# EAGLE design HW2 (EAGLE 7.5.0)
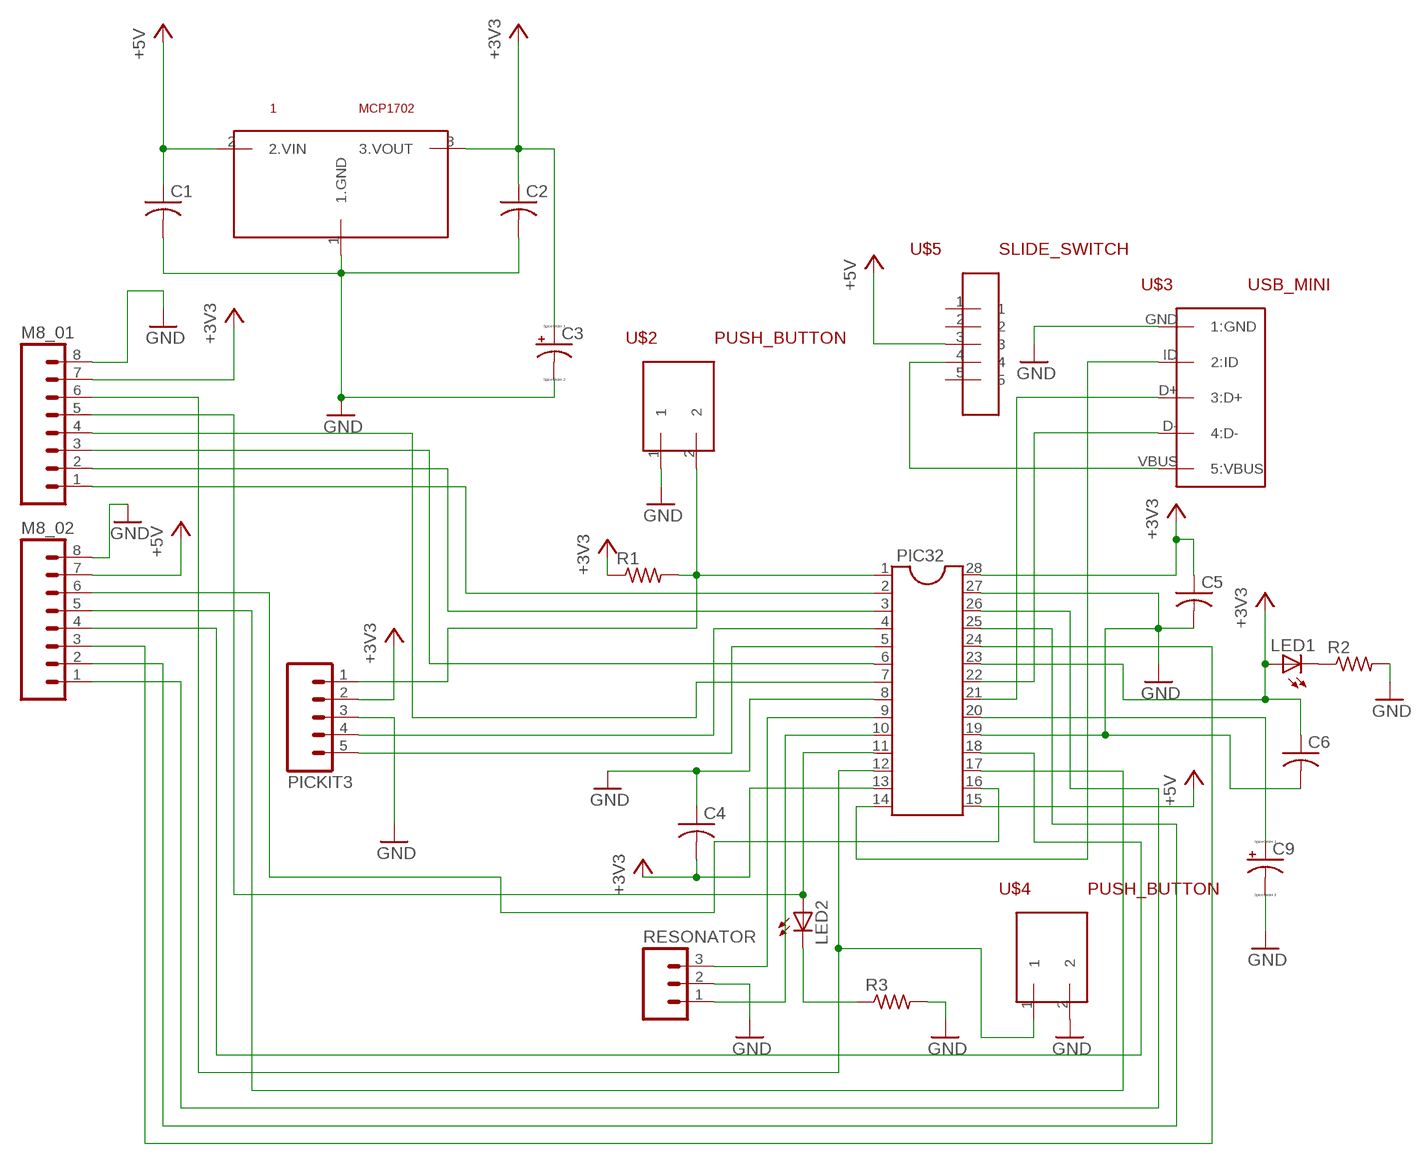
[diagram p0: schematic, sheet 1]

## Parts
1  MCP1702  [TO92]
C1  C-US025-025X050  [C025-025X050]
C2  C-US025-025X050  [C025-025X050]
C3  CPOL-USE5-5  [E5-5]
C4  C-US025-025X050  [C025-025X050]
C5  C-US025-025X050  [C025-025X050]
C6  C-US025-025X050  [C025-025X050]
C9  CPOL-USE5-5  [E5-5]
LED1  LED3MM  [LED3MM]
LED2  LED3MM  [LED3MM]
M8_01  M08  [1X08_ROUND]
M8_02  M08  [1X08_ROUND]
PIC32  DIL28-3  [DIL28-3]
PICKIT3  M05PTH  [1X05]
R1  R-US_0207/10  [0207/10]
R2  R-US_0207/10  [0207/10]
R3  R-US_0207/10  [0207/10]
RESONATOR  M03PTH  [1X03]
U$2  PUSH_BUTTON  [1X02_NO_SILK]
U$3  USB_MINI  [USB-MB-H]
U$4  PUSH_BUTTON  [1X02_NO_SILK]
U$5  SLIDE_SWITCH  [1X05]

## Nets
+3V3: 1.3(3.VOUT) C2.1 C3.+ C4.2 C5.1 C6.1 LED1.A M8_01.7 PIC32.13 PIC32.23 PIC32.28 PICKIT3.2 R1.1
+5V: 1.2(2.VIN) C1.1 M8_02.7 PIC32.15 U$5.3
GND: 1.1(1.GND) C1.2 C2.2 C3.- C4.1 C5.2 C6.2 C9.- M8_01.8 M8_02.8 PIC32.8 PIC32.19 PIC32.27 PICKIT3.3 R2.2 R3.2 RESONATOR.2 U$2.1 U$3.GND(1:GND) U$4.2
N$1: PIC32.5 PICKIT3.5
N$2: PIC32.1(1:!MCLR) PICKIT3.1 R1.2 U$2.2
N$3: U$3.VBUS(5:VBUS) U$5.4
N$4: PIC32.14 U$3.ID(2:ID)
N$5: PIC32.4 PICKIT3.4
N$6: PIC32.21 U$3.D+(3:D+)
N$7: PIC32.22 U$3.D-(4:D-)
N$8: PIC32.9 RESONATOR.3
N$9: M8_01.1 PIC32.2(2:A0)
N$10: LED1.K(C) R2.1
N$11: M8_01.2 PIC32.3
N$12: PIC32.10 RESONATOR.1
N$13: LED2.A M8_01.5 PIC32.11
N$14: LED2.K(C) R3.1
N$15: M8_01.3 PIC32.6
N$16: M8_01.6 PIC32.12 U$4.1
N$17: M8_01.4 PIC32.7
N$18: M8_02.2 PIC32.25
N$19: M8_02.1 PIC32.26
N$20: C9.+ PIC32.20
N$21: M8_02.3 PIC32.24
N$22: M8_02.4 PIC32.18
N$23: M8_02.5 PIC32.17
N$26: M8_02.6 PIC32.16
Unconnected: U$5.1 U$5.2 U$5.5

## Library data of the parts
1 = HWlib:MCP1702
C1 C2 C4-C6 = HWlib:C-US: CAPACITOR, American symbol
C3 C9 = HWlib:CPOL-US: POLARIZED CAPACITOR, American symbol
LED1 LED2 = HWlib:LED: LED OSRAM: - CHIPLED LG R971, LG N971, LY N971, LG Q971, LY Q971, LO R971, LY R971 LH N974, LH R974 LS Q976, LO Q976, LY Q976 LO Q996 - Hyper CHIPLED LW Q18S LB Q993, LB Q99A, LB R99A - SideLED LS A670, LO A670, LY A670, LG A670, LP A670 LB A673, LV A673, LT A673, LW A673 LH A674 LY A675 LS A676, LA A676, LO A676, LY A676, LW A676 LS A679, LY A679, LG A679 - Hyper Micro SIDELED® LS Y876, LA Y876, LO Y876, LY Y876 LT Y87S - SmartLED LW L88C, LW L88S LB L89C, LB L89S, LG L890 LS L89K, LO L89K, LY L89K LS L896, LA L896, LO L896, LY L896 - TOPLED LS T670, LO T670, LY T670, LG T670, LP T670 LSG T670, LSP T670, LSY T670, LOP T670, LYG T670 LG T671, LOG T671, LSG T671 LB T673, LV T673, LT T673, LW T673 LH T674 LS T676, LA T676, LO T676, LY T676, LB T676, LH T676, LSB T676, LW T676 LB T67C, LV T67C, LT T67C, LS T67K, LO T67K, LY T67K, LW E67C LS E67B, LA E67B, LO E67B, LY E67B, LB E67C, LV E67C, LT E67C LW T67C LS T679, LY T679, LG T679 LS T770, LO T770, LY T770, LG T770, LP T770 LB T773, LV T773, LT T773, LW T773 LH T774 LS E675, LA E675, LY E675, LS T675 LS T776, LA T776, LO T776, LY T776, LB T776 LHGB T686 LT T68C, LB T68C - Hyper Mini TOPLED® LB M676 - Mini TOPLED Santana® LG M470 LS M47K, LO M47K, LY M47K Source: http://www.osram.convergy.de LUXEON: - LUMILED® LXK2-PW12-R00, LXK2-PW12-S00, LXK2-PW14-U00, LXK2-PW14-V00 LXK2-PM12-R00, LXK2-PM12-S00, LXK2-PM14-U00 LXK2-PE12-Q00, LXK2-PE12-R00, LXK2-PE12-S00, LXK2-PE14-T00, LXK2-PE14-U00 LXK2-PB12-K00, LXK2-PB12-L00, LXK2-PB12-M00, LXK2-PB14-N00, LXK2-PB14-P00, LXK2-PB14-Q00 LXK2-PR12-L00, LXK2-PR12-M00, LXK2-PR14-Q00, LXK2-PR14-R00 LXK2-PD12-Q00, LXK2-PD12-R00, LXK2-PD12-S00 LXK2-PH12-R00, LXK2-PH12-S00 LXK2-PL12-P00, LXK2-PL12-Q00, LXK2-PL12-R00 Source: www.luxeon.com KINGBRIGHT: KA-3528ASYC Source: www.kingbright.com
M8_01 M8_02 = HWlib:M08: Header 8 Standard 8-pin 0.1" header. Use with straight break away headers (SKU : PRT-00116), right angle break away headers (PRT-00553), swiss pins (PRT-00743), machine pins (PRT-00117), and female headers (PRT-00115).; PROD_ID: CONN-08437
PIC32 = HWlib:DIL28: Dual In Line
PICKIT3 = HWlib:M05: Header 5 Standard 5-pin 0.1" header. Use with straight break away headers (SKU : PRT-00116), right angle break away headers (PRT-00553), swiss pins (PRT-00743), machine pins (PRT-00117), and female headers (PRT-00115). Molex polarized connector foot print use with SKU : PRT-08230 with associated crimp pins and housings.
R1-R3 = HWlib:R-US_: RESISTOR, American symbol
RESONATOR = HWlib:M03: Header 3 Standard 3-pin 0.1" header. Use with straight break away headers (SKU : PRT-00116), right angle break away headers (PRT-00553), swiss pins (PRT-00743), machine pins (PRT-00117), and female headers (PRT-00115). Molex polarized connector foot print use with SKU : PRT-08232 with associated crimp pins and housings.
U$2 U$4 = HWlib:PUSH_BUTTON
U$3 = HWlib:USB_MINI
U$5 = HWlib:SLIDE_SWITCH

## Board
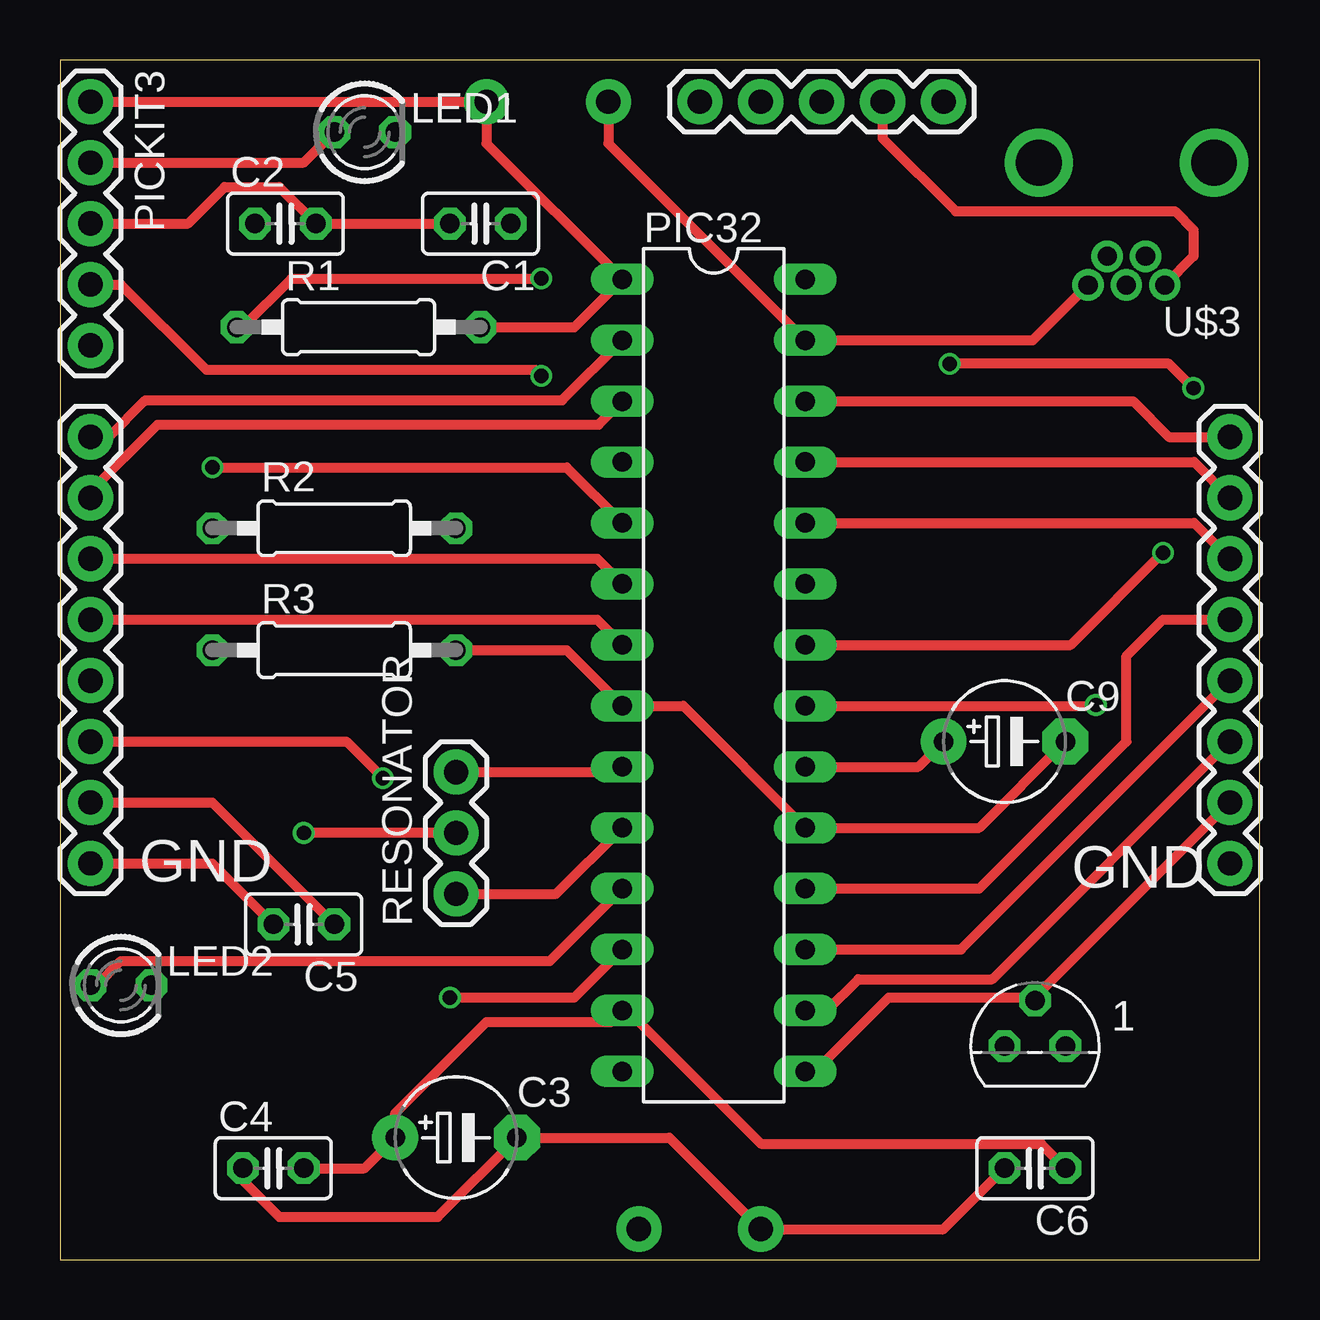
[diagram p1: board, top side]
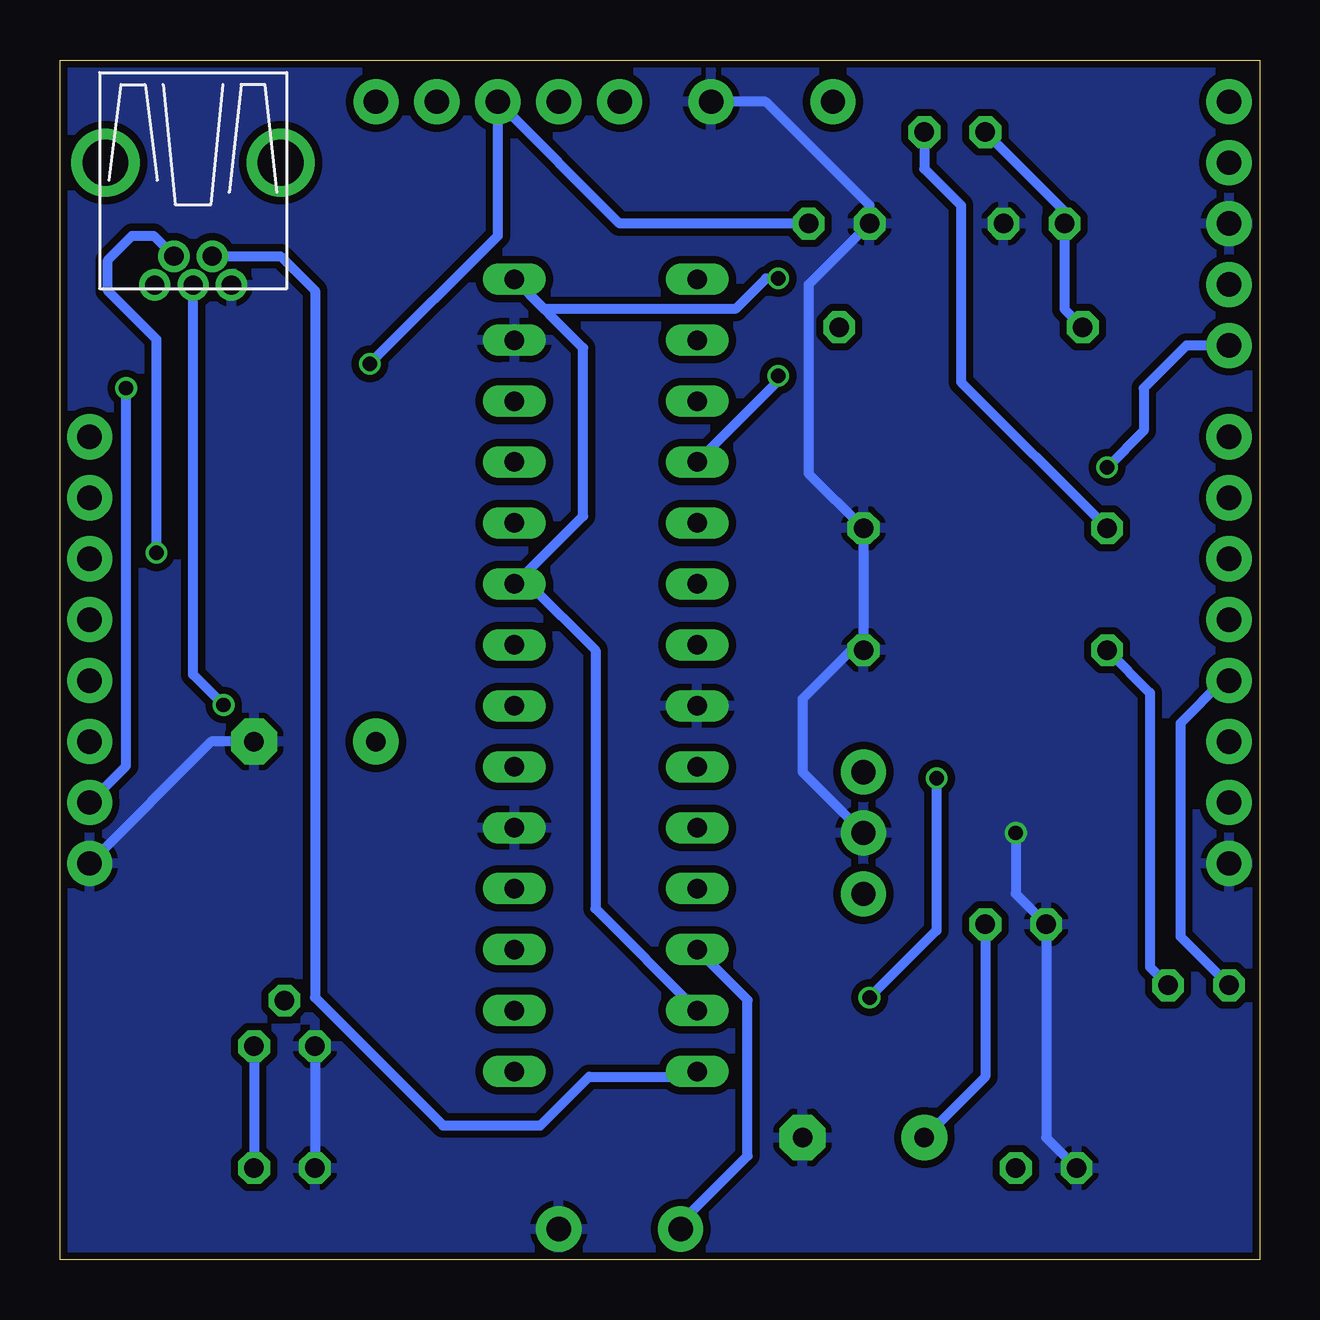
[diagram p2: board, bottom side, seen from below]

Size 50 x 50 mm. Coordinates in mm from the lower left corner, seen from the top.
Outline: 0,0 50,0 50,50 0,50 0,0
Copper layers (1*16): Top 0.035mm / dielectric 1.5mm / Bottom 0.035mm
Design rules "SeeedStudio_2layer_DRU_no_angle_20140221": minimum track width 6mil, minimum drill 12mil, track to track 6mil, track to pad 6mil, pad to pad 6mil, via to via 6mil, smd to smd 0mil, copper to edge 10mil, drill to drill 10mil, minimum pad ring 10mil, minimum via ring 6mil, stop-mask expansion 2mil, vias tented up to drill 100mil, thermal gap 10mil

### Footprints (pad centres in the part's own frame; a part is rotated, then mirrored left to right if it is on the bottom)
TO92 = drill 0.813 octagon: 1 -1.27,0; 2 0,1.905; 3 1.27,0
C025-025X050 = drill 0.813 octagon: 1 -1.27,0; 2 1.27,0
E5-5 = drill 0.813 pad 1.905: + -2.54,0 | drill 0.813 pad 1.905 octagon: - 2.54,0
LED3MM = drill 0.813 octagon: A -1.27,0; K 1.27,0
1X08_ROUND = drill 1.016 pad 1.88: 1 0,0; 2 2.54,0; 3 5.08,0; 4 7.62,0; 5 10.16,0; 6 12.7,0; 7 15.24,0; 8 17.78,0
DIL28-3 = drill 0.813 long: 1 -16.51,-3.81; 2 -13.97,-3.81; 3 -11.43,-3.81; 4 -8.89,-3.81; 5 -6.35,-3.81; 6 -3.81,-3.81; 7 -1.27,-3.81; 8 1.27,-3.81; 9 3.81,-3.81; 10 6.35,-3.81; 11 8.89,-3.81; 12 11.43,-3.81; 13 13.97,-3.81; 14 16.51,-3.81; 15 16.51,3.81; 16 13.97,3.81; 17 11.43,3.81; 18 8.89,3.81; 19 6.35,3.81; 20 3.81,3.81; 21 1.27,3.81; 22 -1.27,3.81; 23 -3.81,3.81; 24 -6.35,3.81; 25 -8.89,3.81; 26 -11.43,3.81; 27 -13.97,3.81; 28 -16.51,3.81
1X05 = drill 1.016 pad 1.88: 1 0,0; 2 2.54,0; 3 5.08,0; 4 7.62,0; 5 10.16,0
0207/10 = drill 0.813 octagon: 1 -5.08,0; 2 5.08,0
1X03 = drill 1.016 pad 1.88: 1 0,0; 2 2.54,0; 3 5.08,0
1X02_NO_SILK = drill 1.016 pad 1.88: 1 0,0; 2 5.08,0
USB-MB-H = drill 0.8: D+ 5.1,0; D- 3.9,0.8; GND 5.1,-1.6; ID 3.9,-0.8; VBUS 5.1,1.6 | drill 1.9: P$6 0,-3.65; P$7 0,3.65

### Placement (x,y rotation side)
1  40.64,8.89 0 top
C1  17.53,43.18 180 top
C2  9.4,43.18 0 top
C3  16.51,5.08 0 top
C4  8.89,3.81 0 top
C5  10.16,13.97 180 top
C6  40.64,3.81 180 top
C9  39.37,21.59 0 top
LED1  12.7,46.99 0 top
LED2  2.54,11.43 0 top
M8_01  1.27,34.29 270 top
M8_02  48.77,34.29 270 top
PIC32  27.25,24.35 270 top
PICKIT3  1.27,48.26 270 top
R1  12.45,38.86 0 top
R2  11.43,30.48 0 top
R3  11.43,25.4 0 top
RESONATOR  16.51,15.24 90 top
U$2  22.86,48.26 180 top
U$3  44.45,45.72 270 top
U$4  24.13,1.27 0 top
U$5  26.67,48.26 0 top

### Tracks (layer width: path | path; a pad name or v marks a point on that pad's centre or on a via)
+3V3  (via drill 0.6)
  Top 0.406: PICKIT3.2 10.16,45.72 LED1.A | C4.2 12.7,3.81 C3.+ 13.97,6.1 17.78,9.91 22.97,9.91 PIC32.13 23.66,10.38 29.21,4.83 40.89,4.83 C6.1 | M8_01.7 6.35,19.05 C5.1 | R1.1 7.62,38.86 9.65,40.89 v20.07,40.89
  Bottom 0.406: 1.3 C6.1 | C5.1 11.43,7.62 C3.+ | LED1.A 8.13,43.69 C2.1 8.13,39.62 R1.1 | v20.07,40.89 20.57,40.89 21.84,39.62 29.82,39.62 PIC32.28 28.19,37.99 28.19,30.99 31.02,28.16 | PIC32.23 31.02,28.16 | 31.02,28.16 30.45,28.16 27.69,25.4 27.69,14.63 PIC32.13
+5V  (via drill 0.6)
  Top 0.406: PIC32.15 31.46,7.84 34.54,10.92 40.51,10.92 1.2 40.64,10.92 M8_02.7 | v47.24,36.32 46.23,37.34 v37.08,37.34
  Bottom 0.406: C1.1 26.67,43.18 U$5.3 31.75,42.67 v37.08,37.34 | M8_02.7 47.24,20.57 v47.24,36.32
GND  (via drill 0.6)
  Top 0.406: R3.2 21.12,25.4 PIC32.8 25.98,23.08 PIC32.19 38.32,18 C9.- | U$3.GND 40.55,38.32 PIC32.27 22.86,46.52 U$2.1 | C6.2 36.83,1.27 U$4.2 25.4,5.08 C3.- 15.75,1.78 9.14,1.78 7.62,3.3 C4.1 | M8_01.8 6.35,16.51 C5.2 | RESONATOR.2 v10.16,17.78 | PICKIT3.3 5.33,43.18 6.86,44.7 9.14,44.7 C2.2 C1.2
  Bottom 0.406: 1.1 C6.2 | C4.1 8.89,5.08 C5.2 10.16,15.24 v10.16,17.78 | U$2.1 20.57,48.26 16.26,43.94 C1.2 18.8,40.64 18.8,32.77 R2.2 R3.2 17.02,25.4 19.05,23.37 19.05,20.32 RESONATOR.2 | C9.- 43.69,21.59 M8_02.8
  pour Bottom (isolate 0.305): 0,50.04 50.04,50.04 50.04,-0.25 0,-0.25
N$1  (via drill 0.6)
  Top 0.406: v6.35,33.02 21.12,33.02 PIC32.5
  Bottom 0.406: PICKIT3.5 3.05,38.1 4.83,36.32 4.83,34.54 v6.35,33.02
N$2
  Top 0.406: PICKIT3.1 U$2.2 17.78,46.52 PIC32.1 21.44,38.86 R1.2
N$3
  Top 0.406: U$5.4 34.29,46.74 37.34,43.69 46.48,43.69 47.24,42.93 47.24,41.81 U$3.VBUS
N$4
  Bottom 0.406: U$3.ID 40.8,41.82 39.37,40.39 39.37,10.92 34.04,5.59 29.97,5.59 27.94,7.62 23.66,7.62 PIC32.14
N$5  (via drill 0.6)
  Top 0.406: PICKIT3.4 2.54,40.64 6.1,37.08 19.81,37.08 v20.07,36.83
  Bottom 0.406: v20.07,36.83 20.07,36.61 PIC32.4
N$6  (via drill 0.6)
  Top 0.406: PIC32.21 43.15,23.08 v43.18,23.11
  Bottom 0.406: v43.18,23.11 44.45,24.38 U$3.D+
N$7  (via drill 0.6)
  Top 0.406: PIC32.22 42.13,25.62 v45.97,29.46
  Bottom 0.406: v45.97,29.46 45.97,38.35 48.01,40.39 48.01,41.66 46.99,42.67 46.1,42.67 U$3.D-
N$8
  Top 0.406: RESONATOR.3 23.22,20.32 PIC32.9
N$9
  Top 0.406: M8_01.1 2.03,34.29 3.56,35.81 20.93,35.81 PIC32.2
N$10
  Bottom 0.406: LED1.K 13.97,45.47 12.45,43.94 12.45,36.58 R2.1
N$11
  Top 0.406: M8_01.2 1.27,32 4.06,34.8 22.46,34.8 PIC32.3
N$12
  Top 0.406: RESONATOR.1 20.68,15.24 PIC32.10
N$13
  Top 0.406: LED2.A 1.52,11.43 2.54,12.45 20.43,12.45 PIC32.11
  Bottom 0.406: M8_01.5 1.52,24.13 3.3,22.35 3.3,13.46 LED2.A
N$14
  Bottom 0.406: R3.1 4.57,23.62 4.57,12.19 LED2.K
N$15
  Top 0.406: M8_01.3 22.39,29.21 PIC32.6
N$16  (via drill 0.6)
  Top 0.406: M8_01.6 11.94,21.59 v13.46,20.07 | v16.26,10.92 21.44,10.92 PIC32.12
  Bottom 0.406: v13.46,20.07 13.46,13.72 v16.26,10.92 | U$4.1 24.13,1.52 21.34,4.32 21.34,10.82 PIC32.12
N$17
  Top 0.406: M8_01.4 22.39,26.67 PIC32.7
N$18
  Top 0.406: PIC32.25 47.28,33.24 M8_02.2
N$19
  Top 0.406: PIC32.26 44.74,35.78 46.23,34.29 M8_02.1
N$20
  Top 0.406: PIC32.20 35.78,20.54 C9.+
N$21
  Top 0.406: PIC32.24 47.28,30.7 M8_02.3
N$22
  Top 0.406: PIC32.18 38.32,15.46 44.45,21.59 44.45,25.15 45.97,26.67 M8_02.4
N$23
  Top 0.406: PIC32.17 37.56,12.92 M8_02.5
N$26
  Top 0.406: PIC32.16 31.97,10.38 33.27,11.68 38.86,11.68 M8_02.6

### Text on the board
tPlace: GND | GND